# EAGLE design Circuito_Alarma (EAGLE 7.3.0)
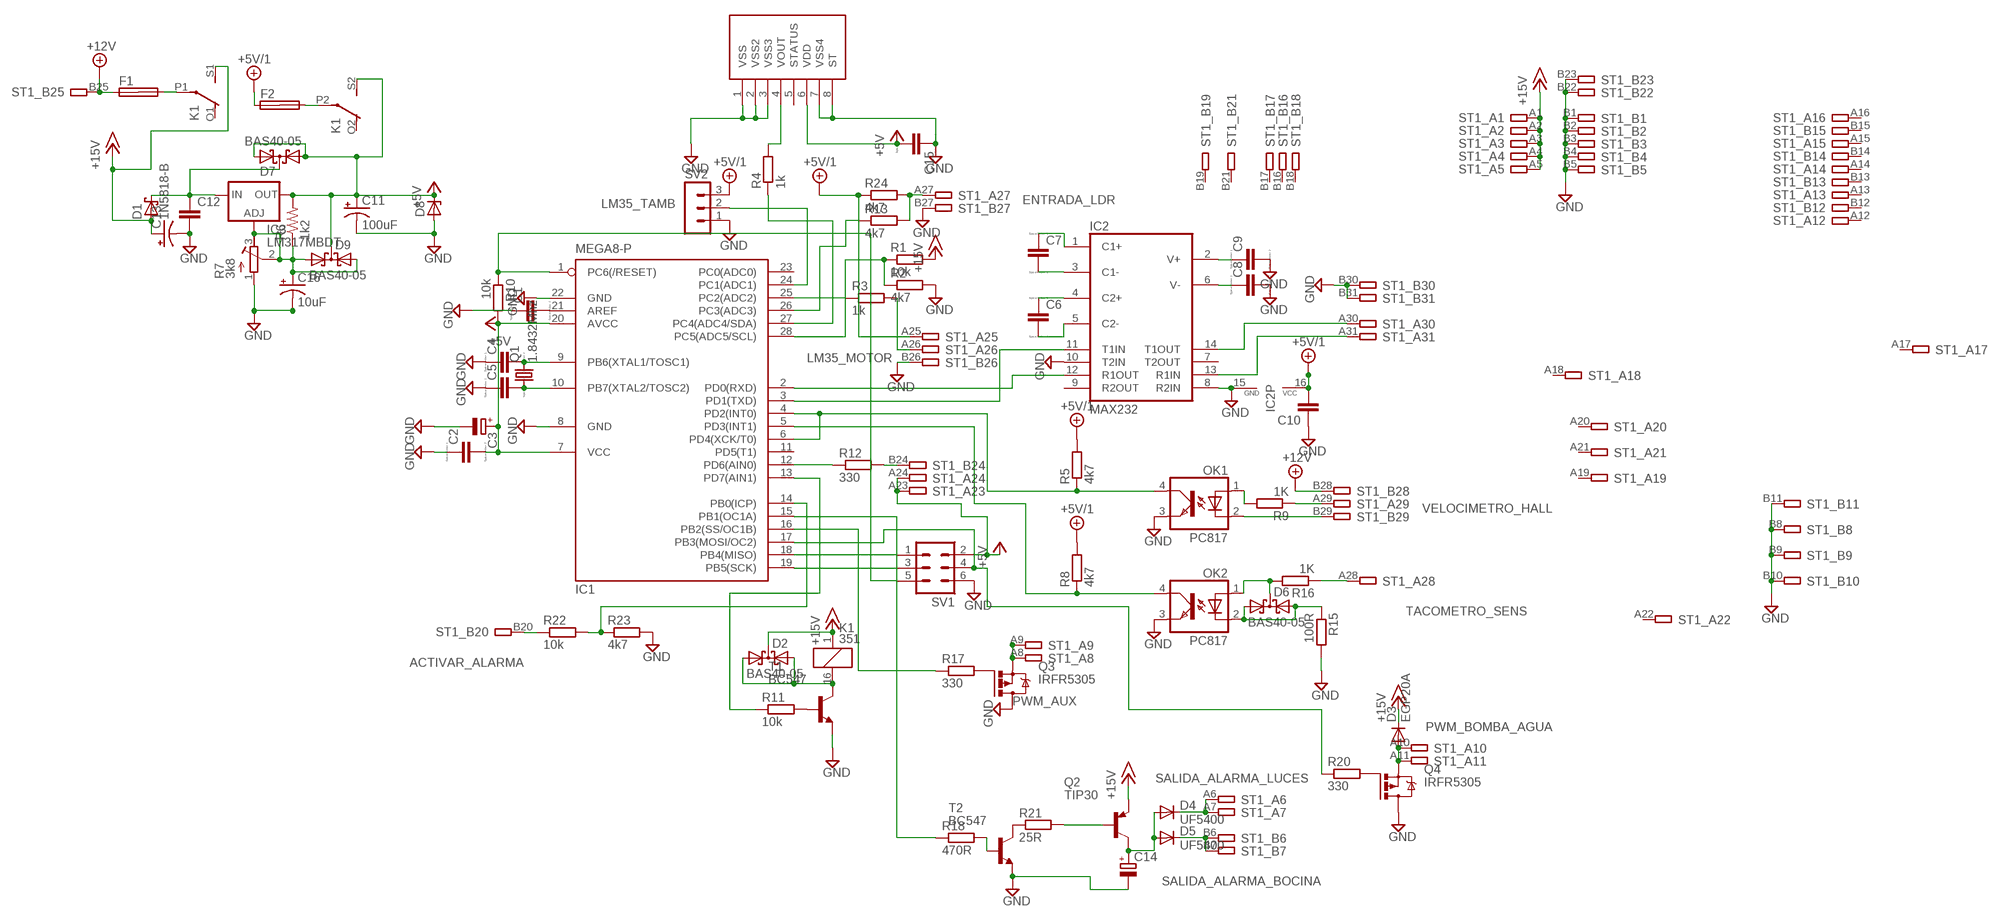
[diagram p0: schematic, sheet 1]

## Parts
C1  CC1206  [C1206]
C2  CC1206  [C1206]
C3  CPOL-EUE2.5-5  [E2,5-5]
C4  CC1206  [C1206]
C5  CC1206  [C1206]
C6  CC1206  [C1206]
C7  CC1206  [C1206]
C8  CC1206  [C1206]
C9  CC1206  [C1206]
C10  C-EU050-024X044  [C050-024X044]
C11  100uF  CPOL-USE2.5-5  [E2,5-5]
C12  C-EU050-024X044  [C050-024X044]
C13  CPOL-USE2.5-5  [E2,5-5]
C14  CPOL-EUE2.5-5  [E2,5-5]
C15  CC1206  [C1206]
C16  10uF  CPOL-USE2.5-5  [E2,5-5]
D1  1N5818-B  [DO41-7.6]
D2  BAS40-05  [SOT23]
D3  EGP20A  [DO15-12]
D4  UF5400  [DO201-15]
D5  UF5400  [DO201-15]
D6  BAS40-05  [SOT23]
D7  BAS40-05  [SOT23]
D8  ZENER-DIODEZD-5  [ZDIO-5]
D9  BAS40-05  [SOT23]
F1  SHK20L  [SHK20L]
F2  SHK20L  [SHK20L]
IC1  MEGA8-P  [DIL28-3]
IC2  MAX232  [DIL16]
IC3  LM317MBDT  [DPACK]
K1  351  [351]
OK1  PC817  [DIL04]
OK2  PC817  [DIL04]
Q1  1.8432Mhz  CRYSTALTC26H  [TC26H]
Q2  TIP30  [TO220]
Q3  IRFR5305  [D-PAK_TO252AA]
Q4  IRFR5305  [D-PAK_TO252AA]
R1  10k  R-EU_0204/5  [0204/5]
R2  4k7  R-EU_0204/5  [0204/5]
R3  1k  R-EU_0204/5  [0204/5]
R4  1k  R-EU_0204/5  [0204/5]
R5  4k7  R-EU_0204/5  [0204/5]
R6  1k2  R-US_M1206  [M1206]
R7  3k8  R-TRIMM64W  [RTRIM64W]
R8  4k7  R-EU_0204/5  [0204/5]
R9  1K  R-EU_0204/5  [0204/5]
R10  10k  R-EU_0204/5  [0204/5]
R11  10k  R-EU_0204/5  [0204/5]
R12  330  R-EU_0204/5  [0204/5]
R13  4k7  R-EU_0204/5  [0204/5]
R15  100R  R-EU_0204/5  [0204/5]
R16  1K  R-EU_0204/5  [0204/5]
R17  330  R-EU_0204/5  [0204/5]
R18  470R  R-EU_0204/5  [0204/5]
R20  330  R-EU_0204/5  [0204/5]
R21  25R  R-EU_0411/12  [0411/12]
R22  10k  R-EU_0204/5  [0204/5]
R23  4k7  R-EU_0204/5  [0204/5]
R24  4k7  R-EU_0204/5  [0204/5]
ST1  IBM8BIT  [IBM8BIT]
SV1  MA03-2  [MA03-2]
SV2  MA03-1  [MA03-1]
T1  BC547  [TO92]
T2  BC547  [TO92]
U$1  MMA1260  [N5]

## Nets
+5V: C2.2 C3.+ C11.+ C15.2 D7.1(A1) D7.2(A2) D8.C D9.3(C) IC1.7(VCC) IC1.20(AVCC) IC3.4(OUT) K1.S2(3:S) R6.2 R10.2 ST1.A23 ST1.A24 SV1.2 U$1.6(VDD)
+5V/1: C10.2 F2.1A IC2.16(VCC) R5.2 R8.2 R24.1 ST1.A25 SV2.3
+12V: F1.1A ST1.B25 ST1.B28
+15V: C13.+ D1.A D2.3(C) D3.C K1.1 K1.S1(2:S) Q2.3(E) R1.2 ST1.A1 ST1.A2 ST1.A3 ST1.A4 ST1.A5
ACTIVAR_ALARMA: R22.1 ST1.B20
ENTRADA_LDR: R13.2 R24.2 ST1.A27
GND: C1.1 C2.1 C3.- C4.1 C5.1 C8.2 C9.2 C10.1 C11.- C12.2 C13.- C14.- C15.1 C16.- D8.A IC1.8(GND) IC1.22(GND) IC2.8(R2IN) IC2.10(T2IN) IC2.15(GND) OK1.3(EMIT) OK2.3(EMIT) Q3.4(D) Q4.4(D) R2.2 R7.1(E) R15.2 R23.2 ST1.B1 ST1.B2 ST1.B3 ST1.B4 ST1.B5 ST1.B8 ST1.B9 ST1.B10 ST1.B11 ST1.B22 ST1.B23 ST1.B26 ST1.B27 ST1.B30 ST1.B31 SV1.6 SV2.1 T1.1(E) T2.1(E) U$1.1(VSS) U$1.2(VSS2) U$1.3(VSS3) U$1.7(VSS4) U$1.8(ST)
LM35_MOTOR: R3.2 ST1.A26
LM35_TAMB: IC1.24(PC1(ADC1)) SV2.2
N$1: IC1.18(PB4(MISO)) SV1.1
N$2: IC1.19(PB5(SCK)) SV1.3
N$3: C4.2 IC1.9(PB6(XTAL1/TOSC1)) Q1.2
N$4: C5.2 IC1.10(PB7(XTAL2/TOSC2)) Q1.1
N$5: IC1.17(PB3(MOSI/OC2)) R20.1 SV1.4
N$6: C1.2 IC1.21(AREF)
N$7: IC1.1(PC6(/RESET)) R10.1 SV1.5
N$8: IC1.28(PC5(ADC5/SCL)) R1.1 R2.1
N$9: IC1.3(PD1(TXD)) IC2.11(T1IN)
N$10: IC1.2(PD0(RXD)) IC2.12(R1OUT)
N$11: C8.1 IC2.6(V-)
N$12: C9.1 IC2.2(V+)
N$13: C6.1 IC2.4(C2+)
N$14: C6.2 IC2.5(C2-)
N$15: C7.2 IC2.3(C1-)
N$16: C7.1 IC2.1(C1+)
N$17: C12.1 D1.C D7.3(C) IC3.3(IN)
N$18: R4.2 U$1.4(VOUT)
N$19: IC1.26(PC3(ADC3)) R13.1
N$21: IC1.25(PC2(ADC2)) R3.1
N$22: F2.2A K1.P2(3:P)
N$23: IC1.15(PB1(OC1A)) R18.1
N$24: IC1.5(PD3(INT1)) OK2.4(COL) R8.1
N$25: IC1.4(PD2(INT0)) IC1.6(PD4(XCK/T0)) OK1.4(COL) R5.1
N$26: D2.1(A1) D2.2(A2) K1.16 T1.3(C)
N$27: R11.2 T1.2(B)
N$28: IC1.16(PB2(SS/OC1B)) R17.1
N$29: R9.1 ST1.A29
N$30: R16.1 ST1.A28
N$31: IC1.13(PD7(AIN1)) R11.1
N$32: D6.3(C) OK2.1(A) R16.2
N$33: IC2.14(T1OUT) ST1.A30
N$34: IC2.13(R1IN) ST1.A31
N$35: C16.+ D9.1(A1) D9.2(A2) IC3.1(ADJ) R6.1 R7.2(S) R7.3(A)
N$36: R12.2 ST1.B24
N$37: IC1.12(PD6(AIN0)) R12.1
N$39: F1.2A K1.P1(2:P)
N$41: OK1.1(A) R9.2
N$42: Q3.1(G) R17.2
N$43: R18.2 T2.2(B)
N$45: IC1.14(PB0(ICP)) R22.2 R23.1
N$47: R21.1 T2.3(C)
N$49: IC1.27(PC4(ADC4/SDA)) R4.1
N$50: Q4.1(G) R20.2
N$53: Q2.1(B) R21.2
N$54: C14.+ D4.A D5.A Q2.2(C)
PWM_AUX: Q3.3(S) ST1.A8 ST1.A9
PWM_BOMBA_AGUA: D3.A Q4.3(S) ST1.A10 ST1.A11
SALIDA_ALARMA_BOCINA: D5.C ST1.B6 ST1.B7
SALIDA_ALARMA_LUCES: D4.C ST1.A6 ST1.A7
TACOMETRO_SENS: D6.1(A1) D6.2(A2) OK2.2(C) R15.1
VELOCIMETRO_HALL: OK1.2(C) ST1.B29
Unconnected: F1.1B F1.2B F2.1B F2.2B IC1.11(PD5(T1)) IC1.23(PC0(ADC0)) IC2.7(T2OUT) IC2.9(R2OUT) K1.O1(2:O) K1.O2(3:O) ST1.A12 ST1.A13 ST1.A14 ST1.A15 ST1.A16 ST1.A17 ST1.A18 ST1.A19 ST1.A20 ST1.A21 ST1.A22 ST1.B12 ST1.B13 ST1.B14 ST1.B15 ST1.B16 ST1.B17 ST1.B18 ST1.B19 ST1.B21 U$1.5(STATUS)

## Library data of the parts
C1 C2 C4-C9 C15 = eagle-ltspice:C: CAPACITOR, European symbol; SPICEMODEL: NONE; SPICEPREFIX: C
C3 C14 = rcl:CPOL-EU: POLARIZED CAPACITOR, European symbol
C10 C12 = rcl:C-EU: CAPACITOR, European symbol
C11 C13 C16 = resistor:CPOL-US: POLARIZED CAPACITOR, American symbol
D1 = diode:1N581*: 1.0A SCHOTTKY BARRIER RECTIFIER Source: http://www.diodes.com/datasheets/ds23001.pdf
D2 D6 D7 D9 = diode:BAS40-05: Silicon Schottky Diodes General-purpose diode for high-speed switching
D3 = diode:EGP20A: DIODE ultra fast-recovery rectifier
D4 D5 = diode:UF5400: DIODE ultra fast rectifier, 3 A
D8 = diode:ZENER-DIODE: Z-Diode
F1 F2 = fuse:SHK20L: FUSE HOLDER 5 x 20 mm, SH contact, SHH1 Schukat, E1073 Buerklin; OC_FARNELL: unknown; OC_NEWARK: unknown
IC1 = atmel:MEGA8-P: MICROCONTROLLER 8 Kbytes FLASH, 1 kbytes SRAM, 512 bytes EEPROM, USART, 4-channel 10 bit ADC, 2-channel 8 bit ADC Pin compatible with Atmega48, ATMega88, ATMega168 Source: avr.lbr; OC_FARNELL: unknown; OC_NEWARK: unknown
IC2 = maxim:MAX232: RS232 TRANSCEIVER; MF: MAXIM; MPN: MAX232ACPE+; OC_FARNELL: 9723773; OC_NEWARK: 68K4544
IC3 = v-reg:LM317?*: 500 mA Adjustable Output Positive Voltage Regulator Source: http://www.onsemi.co.jp .. LM317M-D.PDF
K1 = relay:351: RELAY 2 x switch, Omron; OC_FARNELL: unknown; OC_NEWARK: unknown
OK1 OK2 = optocoupler:PC817: SHARP OPTO COUPLER; MPN: PC817X4J000F; OC_FARNELL: 9707727; OC_NEWARK: 97K7059
Q1 = crystal:CRYSTAL: CRYSTAL; OC_FARNELL: unknown; OC_NEWARK: unknown
Q2 = transistor-pnp:TIP30: PNP Transistor
Q3 Q4 = transistor-power:IRF?5305: HEXFET Power MOSFET Source: http://www.irf.com/product-info/datasheets/data/irfr5305pbf.pdf
R1-R5 R8-R13 R15-R18 R20-R24 = rcl:R-EU_: RESISTOR, European symbol
R6 = rcl:R-US_: RESISTOR, American symbol
R7 = resistor:R-TRIMM: Trimm resistor
ST1 = propias:IBM8BIT: 8-bit CARD IBM/PC-AT
SV1 = con-lstb:MA03-2: PIN HEADER; OC_FARNELL: unknown; OC_NEWARK: unknown
SV2 = con-lstb:MA03-1: PIN HEADER; OC_FARNELL: unknown; OC_NEWARK: unknown
T1 T2 = transistor:BC547: NPN TRANSISTOR
U$1 = propias:MMA1260

## Net classes
0 default: width 0.305 mm, drill 0.61 mm, clearance 0.305 mm
1 POWER: width 2 mm, drill 1 mm, clearance 0.305 mm to class 0, clearance 0.305 mm
2 Sens: width 0.305 mm, drill 0.61 mm, clearance 1 mm to class 0, clearance 1 mm to class 1, clearance 1 mm

## Board
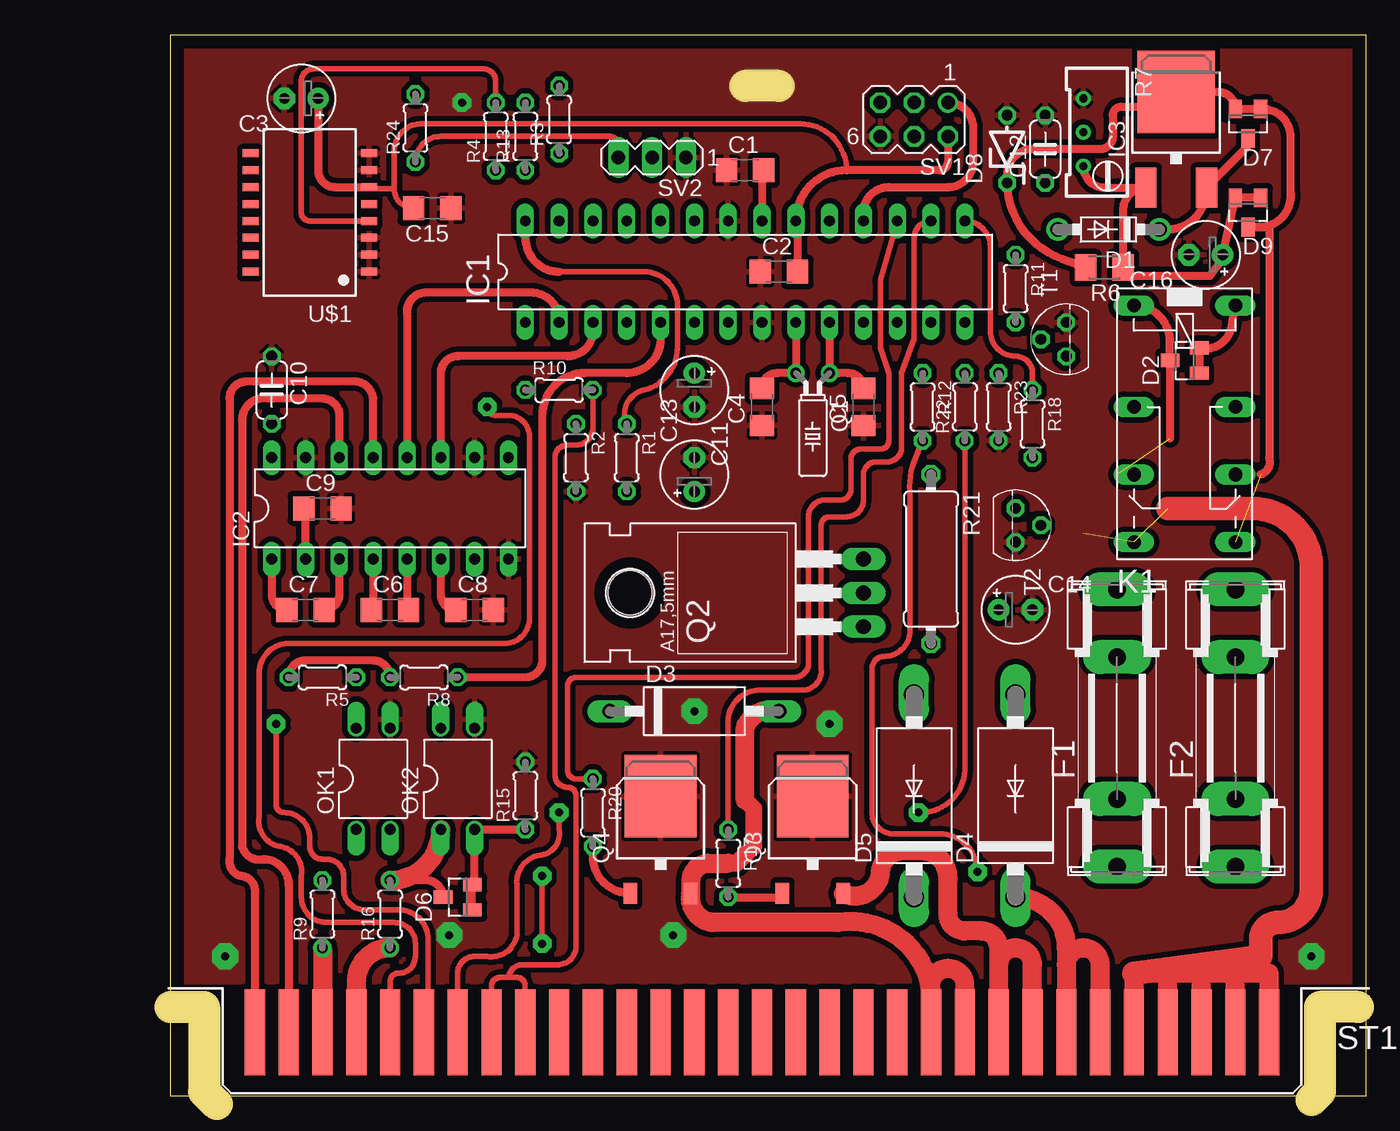
[diagram p1: board, top side]
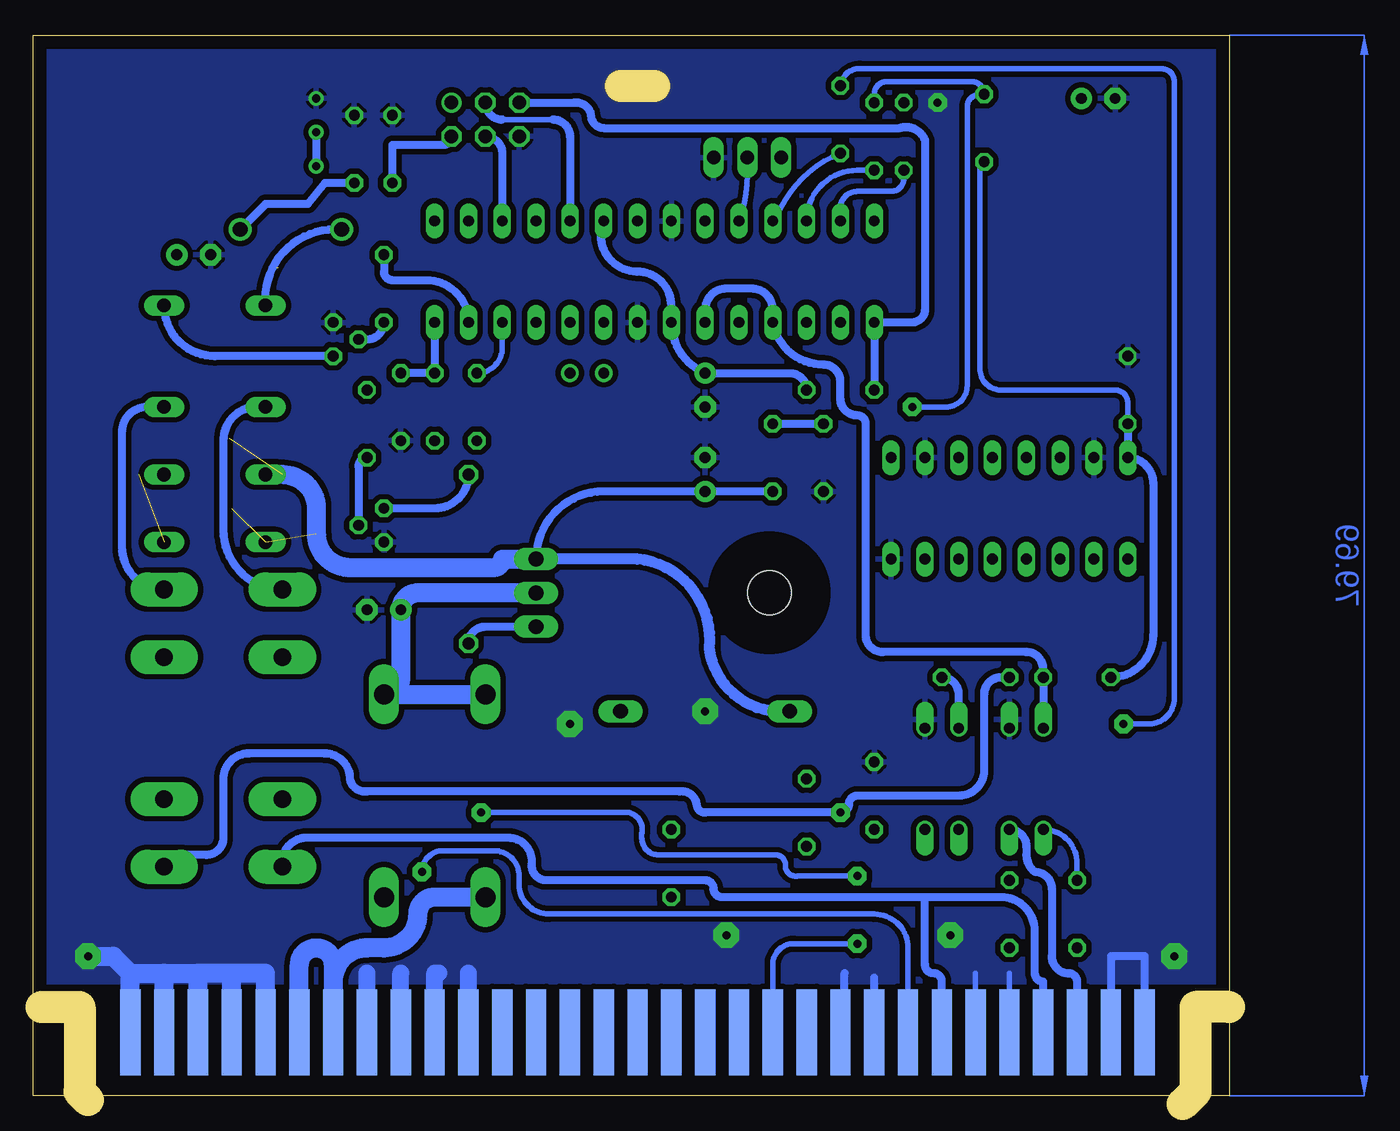
[diagram p2: board, bottom side, seen from below]

Size 89.84 x 79.68 mm. Coordinates in mm from the lower left corner, seen from the top.
Outline: 0,0 89.84,0 89.84,79.68 0,79.68 0,0
Copper layers (1*16): Top 0.035mm / dielectric 1.5mm / Bottom 0.035mm
Design rules "Circuito_Alarma *": minimum track width 10mil, minimum drill 0.7mm, track to track 0.205mm, track to pad 0.205mm, pad to pad 0.205mm, via to via 0.205mm, smd to smd 8mil, copper to edge 40mil, drill to drill 8mil, minimum pad ring 10mil, minimum via ring 0.4mm, stop-mask expansion 4mil, vias tented up to drill 0mil, thermal gap 10mil
Milling: 7 lines

### Footprints (pad centres in the part's own frame; a part is rotated, then mirrored left to right if it is on the bottom)
C1206 = smd 1.6 x 1.8: 1 -1.4,0; 2 1.4,0
E2,5-5 = drill 0.813 pad 1.6: + -1.27,0 | drill 0.813 pad 1.6 octagon: - 1.27,0
C050-024X044 = drill 0.813 octagon: 1 -2.54,0; 2 2.54,0
DO41-7.6 = drill 1.1 pad 1.7: A 3.81,0; C -3.81,0
SOT23 = smd 1 x 1.4: 1 -0.95,-1.1; 2 0.95,-1.1; 3 0,1.1
DO15-12 = drill 1.118 long: A 6.35,0; C -6.35,0
DO201-15 = drill 1.499 long: A 7.62,0; C -7.62,0
ZDIO-5 = drill 0.813 octagon: A 2.54,0; C -2.54,0
SHK20L = drill 1.321 pad 2.54 long: 1A -10.414,0; 1B -5.334,0; 2A 10.414,0; 2B 5.334,0
DIL28-3 = drill 0.813 long: 1 -16.51,-3.81; 2 -13.97,-3.81; 3 -11.43,-3.81; 4 -8.89,-3.81; 5 -6.35,-3.81; 6 -3.81,-3.81; 7 -1.27,-3.81; 8 1.27,-3.81; 9 3.81,-3.81; 10 6.35,-3.81; 11 8.89,-3.81; 12 11.43,-3.81; 13 13.97,-3.81; 14 16.51,-3.81; 15 16.51,3.81; 16 13.97,3.81; 17 11.43,3.81; 18 8.89,3.81; 19 6.35,3.81; 20 3.81,3.81; 21 1.27,3.81; 22 -1.27,3.81; 23 -3.81,3.81; 24 -6.35,3.81; 25 -8.89,3.81; 26 -11.43,3.81; 27 -13.97,3.81; 28 -16.51,3.81
DIL16 = drill 0.813 long: 1 -8.89,-3.81; 2 -6.35,-3.81; 3 -3.81,-3.81; 4 -1.27,-3.81; 5 1.27,-3.81; 6 3.81,-3.81; 7 6.35,-3.81; 8 8.89,-3.81; 9 8.89,3.81; 10 6.35,3.81; 11 3.81,3.81; 12 1.27,3.81; 13 -1.27,3.81; 14 -3.81,3.81; 15 -6.35,3.81; 16 -8.89,3.81
DPACK = smd 1.6 x 3: 1 -2.28,-4.8; 3 2.28,-4.8 | smd 5.8 x 6.2: 4 0,2.38
351 = drill 1.016 long: 1 -3.81,-3.81; 16 -3.81,3.81; O1 8.89,-3.81; O2 8.89,3.81; P1 3.81,-3.81; P2 3.81,3.81; S1 13.97,-3.81; S2 13.97,3.81
DIL04 = drill 0.813 offset: 1 -1.27,-3.81; 2 1.27,-3.81; 3 1.27,3.81; 4 -1.27,3.81
TC26H = drill 0.813: 1 -1.27,0; 2 1.27,0
TO220 = drill 1.118 long: 1 -2.54,-6.35; 2 0,-6.35; 3 2.54,-6.35 | hole 3.302: 0,11.176
D-PAK_TO252AA = smd 1 x 1.6: 1 -2.28,-4.8; 3 2.28,-4.8 | smd 5.4 x 6.2: 4 0,2.5
0204/5 = drill 0.813 octagon: 1 -2.54,0; 2 2.54,0
M1206 = smd 1.6 x 2: 1 -1.4,0; 2 1.4,0
RTRIM64W = drill 0.61: 1 1.27,-2.54; 2 1.27,0; 3 1.27,2.54
0411/12 = drill 0.914 octagon: 1 -6.35,0; 2 6.35,0
IBM8BIT = smd 1.524 x 6.477: A1 -25.4,5.08; A2 -27.94,5.08; A3 -30.48,5.08; A4 -33.02,5.08; A5 -35.56,5.08; A6 -38.1,5.08; A7 -40.64,5.08; A8 -43.18,5.08; A9 -45.72,5.08; A10 -48.26,5.08; A11 -50.8,5.08; A12 -53.34,5.08; A13 -55.88,5.08; A14 -58.42,5.08; A15 -60.96,5.08; A16 -63.5,5.08; A17 -66.04,5.08; A18 -68.58,5.08; A19 -71.12,5.08; A20 -73.66,5.08; A21 -76.2,5.08; A22 -78.74,5.08; A23 -81.28,5.08; A24 -83.82,5.08; A25 -86.36,5.08; A26 -88.9,5.08; A27 -91.44,5.08; A28 -93.98,5.08; A29 -96.52,5.08; A30 -99.06,5.08; A31 -101.6,5.08 | smd 1.524 x 6.477 bottom: B1 -25.4,5.08; B2 -27.94,5.08; B3 -30.48,5.08; B4 -33.02,5.08; B5 -35.56,5.08; B6 -38.1,5.08; B7 -40.64,5.08; B8 -43.18,5.08; B9 -45.72,5.08; B10 -48.26,5.08; B11 -50.8,5.08; B12 -53.34,5.08; B13 -55.88,5.08; B14 -58.42,5.08; B15 -60.96,5.08; B16 -63.5,5.08; B17 -66.04,5.08; B18 -68.58,5.08; B19 -71.12,5.08; B20 -73.66,5.08; B21 -76.2,5.08; B22 -78.74,5.08; B23 -81.28,5.08; B24 -83.82,5.08; B25 -86.36,5.08; B26 -88.9,5.08; B27 -91.44,5.08; B28 -93.98,5.08; B29 -96.52,5.08; B30 -99.06,5.08; B31 -101.6,5.08
MA03-2 = drill 1.016: 1 -2.54,-1.27 | drill 1.016 octagon: 2 -2.54,1.27; 3 0,-1.27; 4 0,1.27; 5 2.54,-1.27; 6 2.54,1.27
MA03-1 = drill 1.016 long: 1 -2.54,0; 2 0,0; 3 2.54,0
TO92 = drill 0.813 octagon: 1 1.27,0; 2 0,1.905; 3 -1.27,0
N5 = smd 0.6 x 1.2: 1 -4.445,-4.445; 2 -3.175,-4.445; 3 -1.905,-4.445; 4 -0.635,-4.445; 5 0.635,-4.445; 6 1.905,-4.445; 7 3.175,-4.445; 8 4.445,-4.445; 9 4.445,4.445; 10 3.175,4.445; 11 1.905,4.445; 12 0.635,4.445; 13 -0.635,4.445; 14 -1.905,4.445; 15 -3.175,4.445; 16 -4.445,4.445

### Placement (x,y rotation side)
C1  43.18,69.53 0 top
C2  45.72,61.91 0 top
C3  9.84,74.93 180 top
C4  44.45,51.75 90 top
C5  52.07,51.75 90 top
C6  16.51,36.51 0 top
C7  10.16,36.51 0 top
C8  22.86,36.51 0 top
C9  11.43,44.13 0 top
C10  7.62,53.02 270 top
C11  39.37,53.02 270 top
C12  65.72,71.12 90 top
C13  39.37,46.67 90 top
C14  63.5,36.51 0 top
C15  19.68,66.68 180 top
C16  77.79,63.18 180 top
D1  70.48,65.09 180 top
D2  76.2,55.24 90 top
D3  39.37,28.89 0 top
D4  63.5,22.54 90 top
D5  55.88,22.54 90 top
D6  21.59,14.92 90 top
D7  80.96,73.03 180 top
D8  62.87,71.12 90 top
D9  80.96,66.36 180 top
DRILEGEND  [DRILEGEND]  -9.38,-13.38 0 top  (outside the outline)
F1  71.12,27.62 90 top
F2  80.01,27.62 90 top
IC1  43.18,61.91 0 top
IC2  16.51,44.13 0 top
IC3  75.56,73.03 0 top
K1  76.2,55.56 270 top
OK1  15.24,23.81 0 top
OK2  21.59,23.81 0 top
Q1  48.26,54.29 180 top
Q2  45.72,37.78 90 top
Q3  48.26,20 0 top
Q4  36.83,20 0 top
R1  34.29,47.94 270 top
R2  30.48,47.94 270 top
R3  29.21,73.34 90 top
R4  24.45,72.07 90 top
R5  11.43,31.43 180 top
R6  70.17,62.23 180 top
R7  69.85,72.39 180 top
R8  19.05,31.43 180 top
R9  11.43,13.65 90 top
R10  29.21,53.02 0 top
R11  63.5,60.64 270 top
R12  56.52,51.75 270 top
R13  26.67,72.07 90 top
R15  26.67,22.54 90 top
R16  16.51,13.65 90 top
R17  41.91,17.46 270 top
R18  64.77,50.48 270 top
R20  31.75,21.27 270 top
R21  57.15,40.32 270 top
R22  59.69,51.75 90 top
R23  62.23,51.75 270 top
R24  18.41,72.71 90 top
ST1  107.95,-0.32 0 top
SV1  55.88,73.34 180 top
SV2  36.2,70.48 180 top
T1  67.31,56.83 90 top
T2  63.5,42.86 270 top
U$1  10.48,66.36 90 top

### Tracks (layer width: path | path; a pad name or v marks a point on that pad's centre or on a via)
+5V  (1 unrouted)
  Top 0.406: 50.8,69.53 arc90 47.31,73.03 18.73,73.03 arc90 16.83,70.8 16.83,68.13 | ST1.A23 26.67,8.25 arc90 26.04,8.89 25.4,8.89 | 25.4,8.89 24.77,8.89 arc90 24.13,8.25 ST1.A24 | R10.2 31.75,50.17 arc-90 30.48,48.89 29.84,48.89 arc90 28.89,47.94 28.89,24.13 arc90 29.84,23.18 arc-90 30.48,22.54 30.48,11.43 arc-90 29.21,9.84 26.67,9.84 arc90 25.4,8.89 | C15.2 arc-90 16.83,68.13 | 16.83,68.13 14.92,68.13 U$1.6
  Top 0.61: C2.2 47.12,65.59 arc90 IC1.20 arc-90 50.8,69.53 57.78,69.53 arc90 58.42,70.17 SV1.2 | 81.92,46.67 arc90 82.55,47.94 82.55,65.26 D9.3 82.08,65.26 arc90 84.14,67.95 84.14,72.22 arc90 D7.1 D7.2 arc90 78.73,75.4 IC3.4 arc90 77.79,74.77 77.79,74.29 71.44,74.29 arc90 70.8,73.66 70.8,72.07 arc-90 69.85,71.12 64.77,71.12 arc90 62.87,69.21 D8.C arc69 66.99,62.86 R6.2 | C3.+ 11.11,69.53 arc90 12.38,68.26 U$1.6
  Bottom 0.61: SV1.2 arc90 59.05,71.44 62.87,71.44 D8.C | IC1.20 arc-113 44.45,61.91 arc90 41.91,59.37 IC1.7 arc-67 C11.+ 33.02,54.29 arc90 R10.2
+5V/1  (via drill 0.6)
  Top 0.406: ST1.A25 21.59,9.21 arc-90 22.86,10.48 23.81,10.48 arc90 26.04,12.07 26.04,15.87 arc-90 27.94,18.1 arc90 29.21,20 v29.21,21.27 | SV2.3 33.66,71.44 arc90 33.02,72.07 20.32,72.07 arc90 R24.1
  Top 0.61: R8.2 arc90 15.24,32.7 10.16,32.7 arc90 R5.2
  Bottom 0.406: C10.2 7.62,52.07 arc-90 8.57,53.02 17.14,53.02 arc90 18.73,54.61 18.73,69.85 arc90 R24.1
  Bottom 0.61: C10.2 IC2.16 arc90 5.71,46.04 5.71,34.61 arc90 R5.2 | R8.2 17.14,31.43 arc-90 18.41,30.16 18.41,24.45 arc90 20.32,22.54 27.94,22.54 arc-90 28.57,21.91 arc90 v29.21,21.27 39.37,21.27 arc90 40.01,21.91 arc-90 41.27,22.86 64.77,22.86 arc90 66.04,23.81 arc-90 67.94,25.72 73.66,25.72 arc-90 75.56,23.81 75.56,19.37 arc90 76.83,18.1 79.12,18.1 arc-90 F2.1A
+12V
  Bottom 0.61: ST1.B28 13.97,8.57 arc90 14.61,9.21 14.61,12.38 arc-90 17.14,14.92 22.86,14.92 | 22.86,14.92 38.1,14.92 arc90 38.73,15.56 arc-90 39.37,16.19 51.44,16.19 arc90 52.39,17.46 arc-90 53.98,19.37 69.6,19.37 arc-90 F1.1A | ST1.B25 21.59,8.57 arc-90 22.23,9.21 arc90 22.86,9.84 22.86,14.92
+15V  (3 unrouted)
  Top 0.61: K1.1 arc-90 75.1,56.66 D2.3 75.1,49.38
  Top 1.422: ST1.A1 82.55,9.21 80.01,9.21 | 80.01,9.21 77.47,9.21 | 77.47,9.21 74.93,9.21 | 74.93,9.21 72.39,9.21 ST1.A5 | ST1.A4 74.93,9.21 | ST1.A2 80.01,9.21 | ST1.A3 77.47,9.21
  Top 1.778: 72.39,9.21 81.92,10.48 81.92,11.75 arc-90 83.19,13.02 arc90 85.72,15.56 85.72,39.69 arc90 81.28,44.13 74.93,44.13
  Bottom 0.61: R1.2 C13.+ 46.99,45.4 arc-90 Q2.3 | K1.1 72.39,60.32 arc90 D1.A
  Bottom 0.813: D3.C arc90 39.05,33.65 arc-90 44.45,40.32 Q2.3
  Bottom 1.422: 71.12,46.67 arc90 68.58,44.13 68.58,42.23 arc-90 66.04,39.69 55.24,39.69 arc-90 54.61,40.32 Q2.3
ACTIVAR_ALARMA  (via drill 0.6)
  Top 0.406: R22.1 59.69,24.45 arc-90 v56.2,21.27 | v27.94,16.51 v27.94,11.43
  Bottom 0.406: v56.2,21.27 45.09,21.27 arc90 44.13,19.69 44.13,19.37 arc-90 42.86,18.1 33.97,18.1 arc90 33.34,17.14 arc-90 32.38,16.51 v27.94,16.51 | ST1.B20 34.29,9.84 arc90 32.7,11.43 v27.94,11.43
ENTRADA_LDR  (via drill 0.6)
  Top 0.406: ST1.A27 16.51,8.57 arc-90 17.14,9.21 arc90 18.41,10.48 18.41,11.43 arc90 16.83,13.02 11.75,13.02 arc-90 9.84,14.92 9.84,16.51 arc90 8.26,18.73 arc-90 6.67,20.96 6.67,31.75 arc-90 8.89,33.97 25.08,33.97 arc90 26.99,35.88 26.99,49.53 arc90 25.4,51.12 24.45,51.12 arc-90 v23.81,51.75
  Bottom 0.406: R13.2 26.67,75.25 arc90 25.72,76.2 19.37,76.2 arc90 R24.2 18.73,75.25 arc-90 19.68,74.29 19.68,53.34 arc90 21.27,51.75 v23.81,51.75
GND  (via drill 0.6, 0.6 pad 1.93)
  Bottom 0.406: ST1.B27 16.51,9.21 | ST1.B26 19.05,9.21
  Bottom 0.61: ST1.B31 6.35,10.48 8.89,10.48 ST1.B30 | ST1.B22 arc-90 28.89,5.08 28.89,9.21 | ST1.B23 26.67,8.89
  Bottom 1.27: ST1.B11 57.15,9.21 | ST1.B10 59.69,9.21 59.37,9.21 | ST1.B9 62.23,9.21 | ST1.B8 64.77,9.21
  Bottom 1.422: ST1.B3 77.47,9.21 | ST1.B1 82.55,9.21 | 82.55,9.21 80.01,9.21 | 80.01,9.21 77.47,9.21 | ST1.B5 72.39,9.21 74.93,9.21 | 74.93,9.21 77.47,9.21 | ST1.B4 74.93,9.21 | ST1.B2 80.01,9.21 | v85.72,10.48 83.82,10.48 82.55,9.21
  other vias: 49.53,27.94 4.13,10.48 20.95,12.06 37.78,12.06 39.37,28.89 21.91,74.61
  pour Top (isolate 0.406): 0,79.69 90.17,79.69 90.17,8.57 0,8.57
  pour Bottom (isolate 0.406): 0,8.57 0,79.69 88.9,79.69 90.17,79.69 90.17,8.57
LM35_MOTOR  (via drill 0.6)
  Top 0.406: ST1.A26 arc90 19.37,5.08 19.37,11.75 arc90 17.14,13.97 14.61,13.97 arc-90 13.02,15.56 13.02,16.51 arc90 11.75,17.78 11.43,17.78 arc-90 10.48,18.73 10.48,19.37 arc90 8.57,21.27 arc-90 7.94,21.91 v7.94,27.94
  Bottom 0.406: R3.2 arc90 27.62,77.15 5.08,77.15 arc90 4.13,76.2 4.13,29.85 arc90 6.03,27.94 v7.94,27.94
LM35_TAMB
  Bottom 0.406: SV2.2 36.2,69.21 arc21 IC1.24
N$1
  Top 0.61: IC1.18 52.07,66.36 arc-90 53.98,68.26 58.42,68.26 arc90 60.33,70.17 60.33,72.71 arc90 SV1.1
N$2
  Bottom 0.406: 54.61,73.34 50.8,73.34
  Bottom 0.61: SV1.3 arc-90 54.61,73.34 | 50.8,73.34 arc90 49.53,72.07 IC1.19
N$3
  Top 0.61: C4.2 arc-90 45.59,54.29 Q1.2 IC1.9
N$4
  Top 0.61: C5.2 arc90 50.93,54.29 50.16,54.29 | 50.16,54.29 Q1.1 | IC1.10 49.53,54.93 arc90 50.16,54.29
N$5
  Top 0.406: 54.61,65.09 IC1.17 53.34,61.28 53.34,56.2 53.98,54.29 53.98,49.21 arc-90 53.34,48.58 52.07,48.58 arc90 51.12,47.94 51.12,45.4 arc-90 50.16,44.77 49.21,44.77 arc90 47.94,43.5 47.94,32.7 arc-90 46.99,31.43 30.48,31.43 arc90 29.84,30.8 29.84,24.45 arc90 30.48,23.81 R20.1
  Bottom 0.61: SV1.4 arc90 54.61,70.8 IC1.17
N$6
  Top 0.61: C1.2 arc90 44.45,69.4 IC1.21
N$7
  Bottom 0.61: SV1.5 49.21,74.61 arc90 47.94,73.66 arc-90 46.99,72.71 24.77,72.71 arc90 22.86,71.76 22.86,59.06 arc90 23.81,58.1 IC1.1 R10.1
N$8
  Top 0.406: 29.21,61.91 35.56,61.91 arc-90 38.1,59.37 38.1,56.2 arc-77 35.56,53.02 arc102 R1.1
  Top 0.61: IC1.28 26.67,64.45 arc90 29.21,61.91
  Bottom 0.61: R2.1 R1.1
N$9
  Top 0.61: IC1.3 31.75,57.47 arc-90 29.84,55.56 21.59,55.56 arc90 20.32,54.29 IC2.11
N$10
  Top 0.61: IC1.2 arc90 27.3,60.32 19.05,60.32 arc90 17.78,58.74 IC2.12
N$11
  Top 0.61: IC2.6 20.32,37.65 arc90 C8.1
N$12
  Top 0.61: IC2.2 10.16,44 arc90 C9.1
N$13
  Top 0.61: IC2.4 15.24,36.64 arc-90 C6.1
N$14
  Top 0.61: IC2.5 17.78,36.64 arc90 C6.2
N$15
  Top 0.61: IC2.3 12.7,37.65 arc-90 C7.2
N$16
  Top 0.61: IC2.1 7.62,37.65 arc90 C7.1
N$17
  Top 0.61: D1.C 75.03,65.09 arc90 IC3.3 80.96,71.34 D7.3
  Bottom 0.61: C12.1 67.94,68.58 69.22,66.99 72.39,66.99 D1.C
N$18
  Top 0.406: R4.2 24.45,76.2 arc90 23.5,77.15 10.79,77.15 arc90 9.84,76.2 9.84,66.36 arc90 10.48,65.72 U$1.4
N$19
  Bottom 0.406: R13.1 27.94,69.53 arc-90 IC1.26
N$21
  Bottom 0.406: IC1.25 33.34,67.31 arc38 R3.1
N$22
  Bottom 0.61: K1.P2 81.28,51.75 arc-90 83.19,49.85 83.19,41.21 arc-90 F2.2A
N$23
  Top 0.406: R18.1 64.77,54.29 arc90 63.5,55.56 arc-90 61.59,57.47 61.59,63.82 arc90 IC1.15
N$24
  Top 0.61: IC1.5 36.83,56.83 arc-90 34.29,54.29 31.11,54.29 arc90 27.94,51.12 27.94,32.7 arc-90 26.67,31.43 R8.1
  Bottom 0.61: OK2.4 20.32,30.16 arc-90 R8.1
N$25
  Bottom 0.61: OK1.4 R5.1 13.97,32.07 arc-90 15.24,33.34 26.04,33.34 arc90 27.3,34.61 27.3,50.48 arc-90 27.94,51.12 arc90 29.21,52.39 29.21,53.66 arc-90 30.48,54.93 arc80 IC1.4 34.29,59.06 arc-90 35.88,60.64 37.78,60.64 arc-90 39.37,59.06 IC1.6
N$26
  Top 0.61: K1.16 79.69,57.64 arc-90 D2.2 D2.1
  Bottom 0.61: T1.3 76.2,55.56 arc90 K1.16
N$27
  Bottom 0.61: T1.2 64.77,56.83 arc-90 R11.2
N$28
  Top 0.406: IC1.16 arc90 55.88,64.45 55.88,56.83 54.93,54.29 54.93,48.58 arc-90 53.66,47.63 53.02,47.63 arc90 52.07,46.67 52.07,44.77 arc-90 50.8,43.5 49.53,43.5 arc90 48.9,42.86 48.9,32.07 arc-90 47.62,30.48 44.45,30.48 arc90 41.91,28.26 R17.1
N$29
  Top 1.422: R9.1 ST1.A29
N$30
  Top 1.422: R16.1 arc90 13.97,8.57 ST1.A28
N$31
  Bottom 0.61: R11.1 63.5,61.91 arc-90 62.87,61.28 60.33,61.28 arc90 IC1.13
N$32
  Top 0.61: D6.3 arc90 19.22,16.19 R16.2
  Top 1.422: R16.2 arc90 OK2.1
N$33
  Top 0.61: ST1.A30 8.89,15.87 arc90 6.99,17.78 arc-90 5.4,18.73 5.4,50.8 arc-90 6.99,52.39 11.43,52.39 arc-90 12.7,51.12 IC2.14
N$34
  Top 0.61: IC2.13 15.24,52.39 arc90 13.65,53.66 5.71,53.66 arc90 4.45,52.39 4.45,17.78 arc90 5.4,16.51 arc-90 6.35,15.24 ST1.A31
N$35  (1 unrouted)
  Top 0.61: 71.44,62.23 arc90 72.07,61.6 78.11,61.6 79.06,62.86 C16.+ D9.2 D9.1 | R7.3 arc90 70.2,68.23 IC3.1 arc90 71.57,66.51 R6.1
  Bottom 0.61: R7.2 R7.3
N$36  (via drill 0.6)
  Top 0.406: R12.2 55.88,47.63 arc27 55.56,45.4 55.56,34.92 arc-90 53.66,33.02 arc90 52.7,32.07 52.7,21.27 arc90 54.29,19.69 57.78,19.69 arc-90 v60.64,16.83
  Bottom 0.406: ST1.B24 24.13,11.11 arc-90 26.67,13.65 51.12,13.65 arc90 53.34,15.87 53.34,16.51 arc-90 55.24,18.42 59.05,18.42 arc-90 v60.64,16.83
N$37
  Bottom 0.406: R12.1 arc-90 54.61,56.2 IC1.12
N$39
  Bottom 0.61: K1.P1 73.03,51.75 arc-90 75.56,49.21 75.56,42.48 arc-90 F1.2A
N$41
  Bottom 0.406: OK1.1 arc90 11.43,17.46 R9.2
N$42
  Top 0.61: R17.2 45.7,14.92 arc90 Q3.1
N$43
  Bottom 0.61: R18.2 arc-90 65.41,47.31 T2.2
N$45
  Bottom 0.61: IC1.14 R22.2 R23.1
N$47
  Bottom 0.61: R21.1 arc90 59.69,44.13 T2.3
N$49
  Bottom 0.406: IC1.27 29.21,66.68 arc90 27.94,67.95 25.4,67.95 arc-90 24.45,68.9 R4.1
N$50
  Top 0.61: Q4.1 arc-90 31.75,18 R20.2
N$53
  Bottom 0.61: R21.2 arc90 55.88,35.24 Q2.1
N$54
  Bottom 1.422: Q2.2 60.96,37.78 arc-90 C14.+ 62.23,31.43 arc90 D4.A D5.A
PWM_AUX
  Top 1.422: ST1.A8 64.77,9.84 arc180 62.23,9.84 | ST1.A9 62.23,9.84 | 62.23,9.84 62.23,11.11 arc90 60.96,12.38 59.69,12.38 arc-90 58.42,13.65 58.42,16.19 arc90 56.52,18.42 55.24,18.42 arc90 53.34,16.83 arc-114 Q3.3
PWM_BOMBA_AGUA
  Top 1.27: 43.18,22.23 43.81,21.59 43.81,18.73 42.55,17.46 41.91,17.46
  Top 1.422: ST1.A10 59.69,8.57 arc180 57.15,7.94 | ST1.A11 57.15,7.94 | 57.15,7.94 arc90 50.16,13.02 40.66,13.02 arc-90 Q4.3 39.11,15.93 arc-90 40.32,17.46 41.91,17.46 | 43.18,22.23 43.18,27.62 arc-90 D3.A
SALIDA_ALARMA_BOCINA
  Bottom 1.422: D5.C 59.69,14.92 arc-90 60.96,13.65 arc90 63.5,11.11 64.77,11.11 arc-90 67.31,8.57 | 67.31,8.57 ST1.B7 | ST1.B6 69.85,9.84 arc180 67.31,9.84 67.31,8.57
SALIDA_ALARMA_LUCES
  Top 1.422: D4.C arc-90 67.31,11.11 67.31,9.84 | 67.31,9.84 ST1.A7 | ST1.A6 69.85,9.84 arc180 67.31,9.84
TACOMETRO_SENS
  Top 0.61: D6.1 D6.2 arc90 22.86,16.04 OK2.2 R15.1
VELOCIMETRO_HALL
  Bottom 0.61: OK1.2 arc90 15.24,18.73 15.24,18.1 arc-53 14.61,16.83 arc90 13.34,15.56 13.34,10.48 arc-90 12.06,9.21 arc90 11.43,8.57 ST1.B29
(copper drawn outside any net)
  shapes: Bottom area x1

### Text on the board
DrillLegend: LAYER-STACK
DrillLegend_01-16: 01-16
DrillLegend_01-20: 01-20